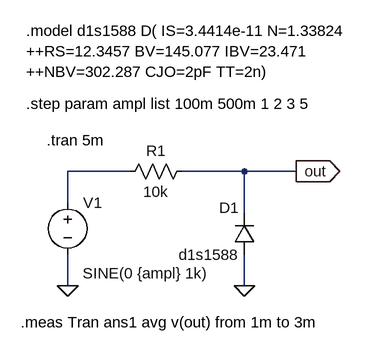
[diagram p0: schematic fig19.asc]
fig19.asc, the LTspice schematic file:
Version 4
SHEET 1 880 680
WIRE 192 96 96 96
WIRE 368 96 272 96
WIRE 448 96 368 96
WIRE 96 144 96 96
WIRE 368 160 368 96
WIRE 96 272 96 224
WIRE 368 272 368 224
FLAG 96 272 0
FLAG 368 272 0
FLAG 448 96 out
IOPIN 448 96 Out
SYMBOL voltage 96 128 R0
WINDOW 3 23 125 Left 0
WINDOW 123 0 0 Left 0
WINDOW 39 0 0 Left 0
SYMATTR Value SINE(0 {ampl} 1k)
SYMATTR InstName V1
SYMBOL res 176 112 R270
WINDOW 0 32 56 VTop 0
WINDOW 3 0 56 VBottom 0
SYMATTR InstName R1
SYMATTR Value 10k
SYMBOL diode 384 224 R180
WINDOW 0 24 72 Left 0
WINDOW 3 24 0 Left 0
SYMATTR InstName D1
SYMATTR Value d1s1588
TEXT 64 48 Left 0 !.tran 5m
TEXT 32 -8 Left 0 !.step param ampl list 100m 500m 1 2 3 5
TEXT 24 328 Left 0 !.meas Tran ans1 avg v(out) from 1m to 3m
TEXT 32 -120 Left 0 !.model d1s1588 D( IS=3.4414e-11 N=1.33824 \n++RS=12.3457 BV=145.077 IBV=23.471 \n++NBV=302.287 CJO=2pF TT=2n)

The netlist it stands for:
* fig19.asc
V1 N001 0 SINE(0 {ampl} 1k)
R1 N001 out 10k
D1 0 out d1s1588
.model D D
.lib standard.dio
.tran 5m
.step param ampl list 100m 500m 1 2 3 5
.meas Tran ans1 avg v(out) from 1m to 3m
.model d1s1588 D( IS=3.4414e-11 N=1.33824
++RS=12.3457 BV=145.077 IBV=23.471
++NBV=302.287 CJO=2pF TT=2n)
.backanno
.end